# Altium schematic sheet connectors.SchDoc
size Letter
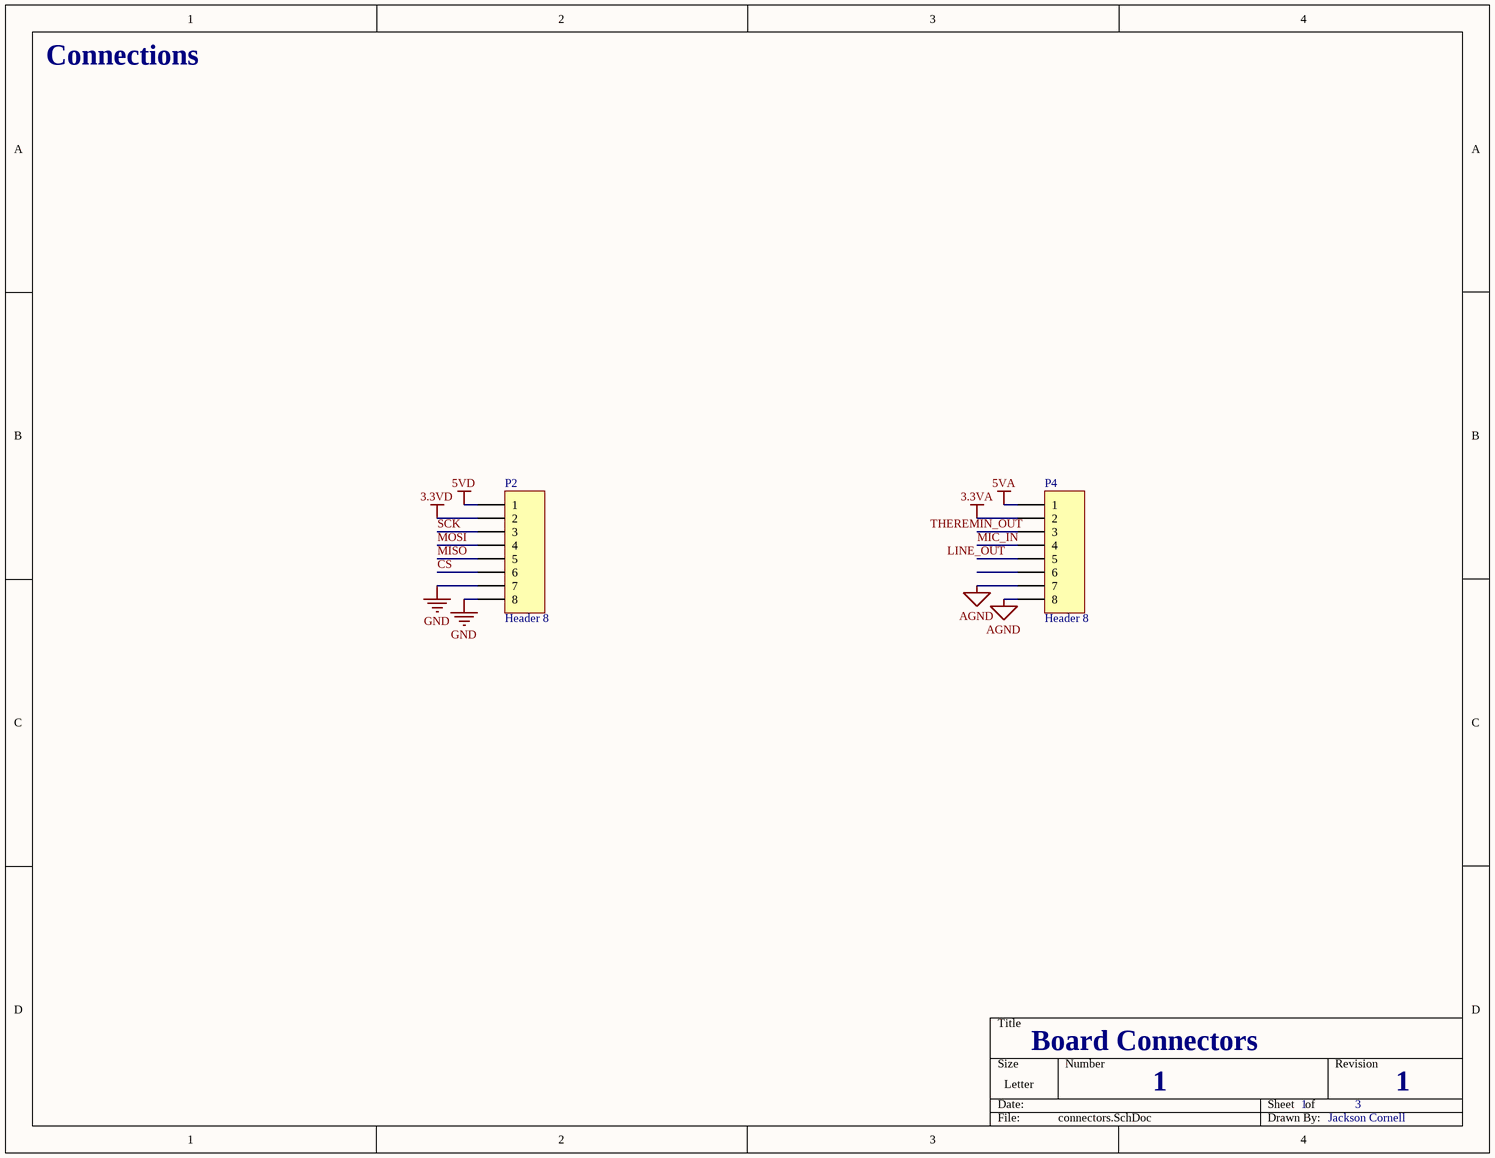
[diagram p0: connectors.SchDoc]

## Parts
P2  Header 8  [HDR1X8]
P4  Header 8  [HDR1X8]

## Nets
3.3VA: P4.2
3.3VD: P2.2
5VA: P4.1
5VD: P2.1
AGND: P4.7 P4.8
GND: P2.7 P2.8
CS: P2.6
LINE_OUT: P4.5
MIC_IN: P4.4
MISO: P2.5
MOSI: P2.4
SCK: P2.3
THEREMIN_OUT: P4.3

Not connected (* = marked no-connect by the designer): P4 6

## Notes on the sheet
- Connections
- Board Connectors
- 1
- 3
- Jackson Cornell

## Library data of the parts
P2 P4 = Header 8: Header, 8-Pin; LatestRevisionDate: 17-Jul-2002; LatestRevisionNote: Re-released for DXP Platform.; Publisher: Altium Limited